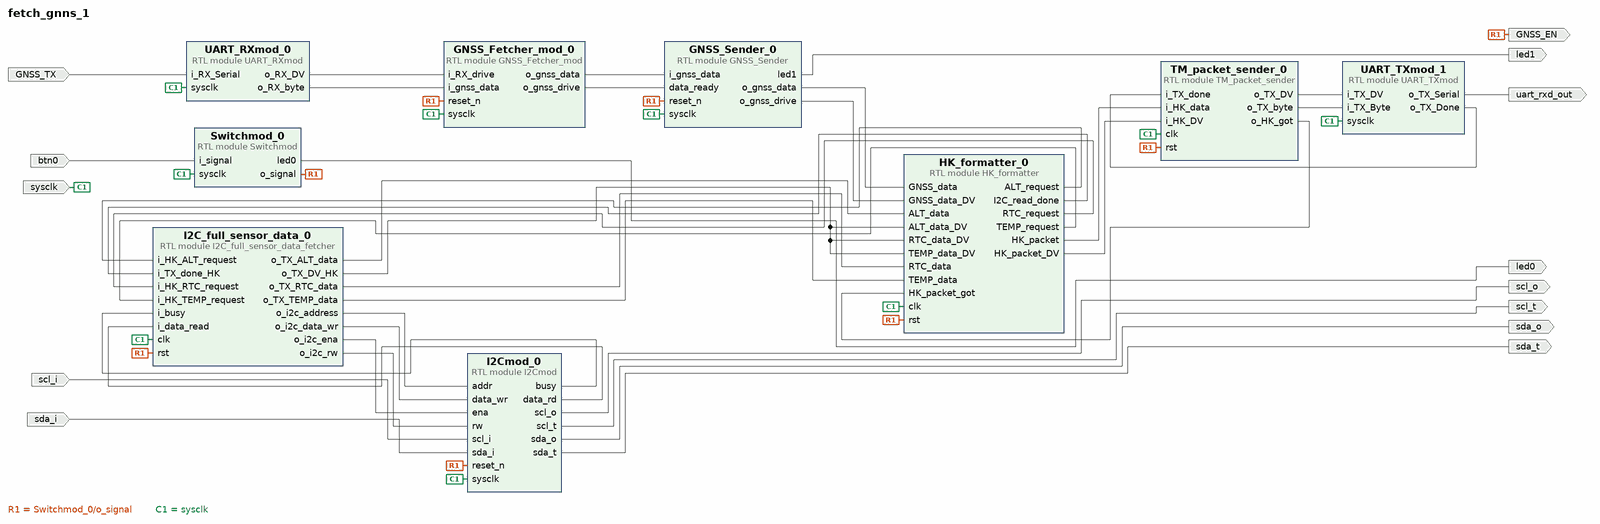
[diagram p0: block diagram of the top level]
# Vivado block design fetch_gnns_1, xc7a35tcpg236-1, Vivado 2024.2
create_bd_design fetch_gnns_1

create_bd_port -dir I sysclk
create_bd_port -dir I GNSS_TX
create_bd_port -dir I btn0
create_bd_port -dir O led0
create_bd_port -dir O GNSS_EN
create_bd_port -dir O led1
create_bd_port -dir O uart_rxd_out
create_bd_port -dir I scl_i
create_bd_port -dir O scl_o
create_bd_port -dir O scl_t
create_bd_port -dir I sda_i
create_bd_port -dir O sda_o
create_bd_port -dir O sda_t

create_bd_cell -type module -reference Switchmod Switchmod_0
create_bd_cell -type module -reference UART_RXmod UART_RXmod_0
set_property -dict {CONFIG.Baud_Rate 9600} [get_bd_cells UART_RXmod_0]
create_bd_cell -type module -reference GNSS_Fetcher_mod GNSS_Fetcher_mod_0
create_bd_cell -type module -reference GNSS_Sender GNSS_Sender_0
create_bd_cell -type module -reference HK_formatter HK_formatter_0
create_bd_cell -type module -reference I2C_full_sensor_data_fetcher I2C_full_sensor_data_0
create_bd_cell -type module -reference I2Cmod I2Cmod_0
create_bd_cell -type module -reference TM_packet_sender TM_packet_sender_0
create_bd_cell -type module -reference UART_TXmod UART_TXmod_1

# ---- connections ----

connect_bd_net [get_bd_pins GNSS_Fetcher_mod_0/o_gnss_data] [get_bd_pins GNSS_Sender_0/i_gnss_data]
connect_bd_net [get_bd_pins GNSS_Fetcher_mod_0/o_gnss_drive] [get_bd_pins GNSS_Sender_0/data_ready]
connect_bd_net [get_bd_pins GNSS_Sender_0/led1] [get_bd_ports led1]
connect_bd_net [get_bd_pins GNSS_Sender_0/o_gnss_data] [get_bd_pins HK_formatter_0/GNSS_data]
connect_bd_net [get_bd_pins GNSS_Sender_0/o_gnss_drive] [get_bd_pins HK_formatter_0/GNSS_data_DV]
connect_bd_net [get_bd_pins HK_formatter_0/ALT_request] [get_bd_pins I2C_full_sensor_data_0/i_HK_ALT_request]
connect_bd_net [get_bd_pins HK_formatter_0/HK_packet] [get_bd_pins TM_packet_sender_0/i_HK_data]
connect_bd_net [get_bd_pins HK_formatter_0/HK_packet_DV] [get_bd_pins TM_packet_sender_0/i_HK_DV]
connect_bd_net [get_bd_pins HK_formatter_0/I2C_read_done] [get_bd_pins I2C_full_sensor_data_0/i_TX_done_HK]
connect_bd_net [get_bd_pins HK_formatter_0/RTC_request] [get_bd_pins I2C_full_sensor_data_0/i_HK_RTC_request]
connect_bd_net [get_bd_pins HK_formatter_0/TEMP_request] [get_bd_pins I2C_full_sensor_data_0/i_HK_TEMP_request]
connect_bd_net [get_bd_pins I2C_full_sensor_data_0/o_TX_ALT_data] [get_bd_pins HK_formatter_0/ALT_data]
connect_bd_net [get_bd_pins I2C_full_sensor_data_0/o_TX_DV_HK] \
  [get_bd_pins HK_formatter_0/RTC_data_DV] [get_bd_pins HK_formatter_0/ALT_data_DV] [get_bd_pins HK_formatter_0/TEMP_data_DV]
connect_bd_net [get_bd_pins I2C_full_sensor_data_0/o_TX_RTC_data] [get_bd_pins HK_formatter_0/RTC_data]
connect_bd_net [get_bd_pins I2C_full_sensor_data_0/o_TX_TEMP_data] [get_bd_pins HK_formatter_0/TEMP_data]
connect_bd_net [get_bd_pins I2C_full_sensor_data_0/o_i2c_address] [get_bd_pins I2Cmod_0/addr]
connect_bd_net [get_bd_pins I2C_full_sensor_data_0/o_i2c_data_wr] [get_bd_pins I2Cmod_0/data_wr]
connect_bd_net [get_bd_pins I2C_full_sensor_data_0/o_i2c_ena] [get_bd_pins I2Cmod_0/ena]
connect_bd_net [get_bd_pins I2C_full_sensor_data_0/o_i2c_rw] [get_bd_pins I2Cmod_0/rw]
connect_bd_net [get_bd_pins I2Cmod_0/busy] [get_bd_pins I2C_full_sensor_data_0/i_busy]
connect_bd_net [get_bd_pins I2Cmod_0/data_rd] [get_bd_pins I2C_full_sensor_data_0/i_data_read]
connect_bd_net [get_bd_pins I2Cmod_0/scl_o] [get_bd_ports scl_o]
connect_bd_net [get_bd_pins I2Cmod_0/scl_t] [get_bd_ports scl_t]
connect_bd_net [get_bd_pins I2Cmod_0/sda_o] [get_bd_ports sda_o]
connect_bd_net [get_bd_pins I2Cmod_0/sda_t] [get_bd_ports sda_t]
connect_bd_net [get_bd_pins Switchmod_0/led0] [get_bd_ports led0]
connect_bd_net [get_bd_pins Switchmod_0/o_signal] \
  [get_bd_ports GNSS_EN] [get_bd_pins GNSS_Sender_0/reset_n] [get_bd_pins GNSS_Fetcher_mod_0/reset_n] \
  [get_bd_pins TM_packet_sender_0/rst] [get_bd_pins I2Cmod_0/reset_n] [get_bd_pins I2C_full_sensor_data_0/rst] \
  [get_bd_pins HK_formatter_0/rst]
connect_bd_net [get_bd_pins TM_packet_sender_0/o_HK_got] [get_bd_pins HK_formatter_0/HK_packet_got]
connect_bd_net [get_bd_pins TM_packet_sender_0/o_TX_DV] [get_bd_pins UART_TXmod_1/i_TX_DV]
connect_bd_net [get_bd_pins TM_packet_sender_0/o_TX_byte] [get_bd_pins UART_TXmod_1/i_TX_Byte]
connect_bd_net [get_bd_pins UART_RXmod_0/o_RX_DV] [get_bd_pins GNSS_Fetcher_mod_0/i_RX_drive]
connect_bd_net [get_bd_pins UART_RXmod_0/o_RX_byte] [get_bd_pins GNSS_Fetcher_mod_0/i_gnss_data]
connect_bd_net [get_bd_pins UART_TXmod_1/o_TX_Done] [get_bd_pins TM_packet_sender_0/i_TX_done]
connect_bd_net [get_bd_pins UART_TXmod_1/o_TX_Serial] [get_bd_ports uart_rxd_out]
connect_bd_net -net i_RX_Serial_0_1 [get_bd_ports GNSS_TX] [get_bd_pins UART_RXmod_0/i_RX_Serial]
connect_bd_net -net i_signal_0_1 [get_bd_ports btn0] [get_bd_pins Switchmod_0/i_signal]
connect_bd_net -net scl_i_0_1 [get_bd_ports scl_i] [get_bd_pins I2Cmod_0/scl_i]
connect_bd_net -net sda_i_0_1 [get_bd_ports sda_i] [get_bd_pins I2Cmod_0/sda_i]
connect_bd_net -net sysclk_0_1 [get_bd_ports sysclk] \
  [get_bd_pins UART_RXmod_0/sysclk] [get_bd_pins Switchmod_0/sysclk] [get_bd_pins GNSS_Sender_0/sysclk] \
  [get_bd_pins GNSS_Fetcher_mod_0/sysclk] [get_bd_pins TM_packet_sender_0/clk] [get_bd_pins UART_TXmod_1/sysclk] \
  [get_bd_pins I2Cmod_0/sysclk] [get_bd_pins I2C_full_sensor_data_0/clk] [get_bd_pins HK_formatter_0/clk]

validate_bd_design
save_bd_design
